# EAGLE schematic cyberstick3_new (EAGLE 7.4.0)
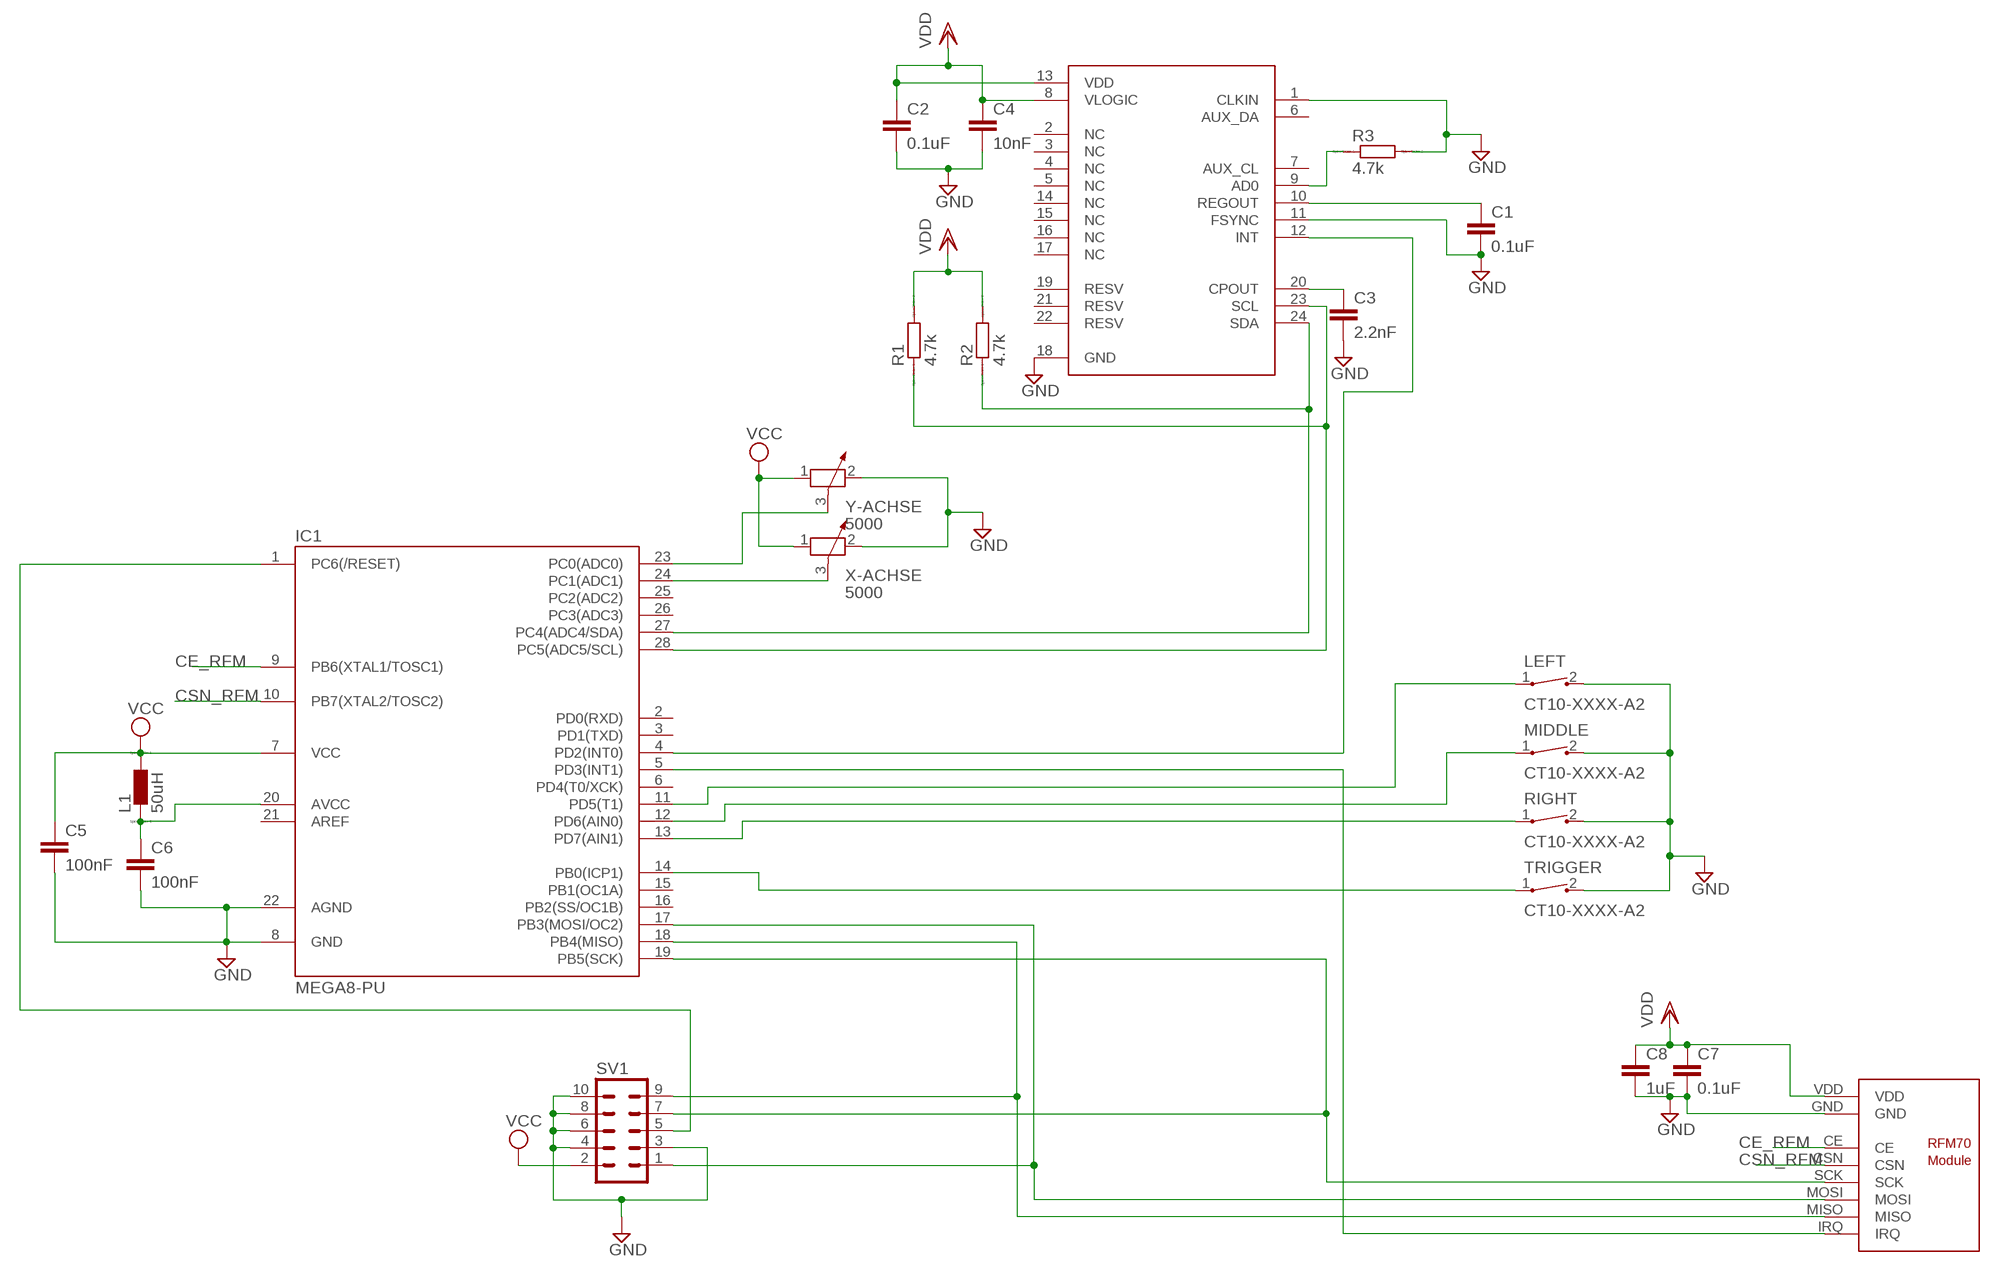
[diagram p0: schematic, sheet 1]

## Parts
C1  0.1uF  C2,5-3  [C2.5-3]
C2  0.1uF  C2,5-3  [C2.5-3]
C3  2.2nF  C2,5-3  [C2.5-3]
C4  10nF  C2,5-3  [C2.5-3]
C5  100nF  C2,5-3  [C2.5-3]
C6  100nF  C2,5-3  [C2.5-3]
C7  0.1uF  C2,5-3  [C2.5-3]
C8  1uF  C2,5-3  [C2.5-3]
IC1  MEGA8-PU  [DIL28-3]
L1  50uH  L0204/7  [0204/7]
LEFT  CT10-XXXX-A2  [CT10-XXXX-A2]
MIDDLE  CT10-XXXX-A2  [CT10-XXXX-A2]
R1  4.7k  R0204/7  [0204/7]
R2  4.7k  R0204/7  [0204/7]
R3  4.7k  R0204/7  [0204/7]
RIGHT  CT10-XXXX-A2  [CT10-XXXX-A2]
SV1  MA05-2  [MA05-2]
TRIGGER  CT10-XXXX-A2  [CT10-XXXX-A2]
U1  MPU6050  [MPU6050]
U$2  RFM70  [RFM70]
X-ACHSE  5000  POTENTIOMETER_PT-10  [PT-10]
Y-ACHSE  5000  POTENTIOMETER_PT-10  [PT-10]

## Nets
CE_RFM: IC1.9(PB6(XTAL1/TOSC1)) U$2.CE
CSN_RFM: IC1.10(PB7(XTAL2/TOSC2)) U$2.CSN
GND: C1.2 C2.2 C3.2 C4.2 C5.2 C6.2 C7.2 C8.2 IC1.8(GND) IC1.22(AGND) LEFT.2 MIDDLE.2 R3.2 RIGHT.2 SV1.3 SV1.4 SV1.6 SV1.8 SV1.10 TRIGGER.2 U1.1(CLKIN) U1.11(FSYNC) U1.18(GND) U$2.GND X-ACHSE.2 Y-ACHSE.2
N$1: IC1.14(PB0(ICP1)) TRIGGER.1
N$2: IC1.4(PD2(INT0)) U1.12(INT)
N$3: IC1.19(PB5(SCK)) SV1.7 U$2.SCK
N$4: IC1.13(PD7(AIN1)) RIGHT.1
N$6: IC1.24(PC1(ADC1)) X-ACHSE.3
N$7: IC1.23(PC0(ADC0)) Y-ACHSE.3
N$8: IC1.17(PB3(MOSI/OC2)) SV1.1 U$2.MOSI
N$9: IC1.1(PC6(/RESET)) SV1.5
N$10: IC1.27(PC4(ADC4/SDA)) R2.1 U1.24(SDA)
N$11: IC1.12(PD6(AIN0)) MIDDLE.1
N$13: C3.1 U1.20(CPOUT)
N$14: C1.1 U1.10(REGOUT)
N$15: IC1.18(PB4(MISO)) SV1.9 U$2.MISO
N$16: IC1.28(PC5(ADC5/SCL)) R1.1 U1.23(SCL)
N$17: IC1.11(PD5(T1)) LEFT.1
N$18: C6.1 IC1.20(AVCC) L1.2
N$19: IC1.5(PD3(INT1)) U$2.IRQ
N$21: R3.1 U1.9(AD0)
VCC: C5.1 IC1.7(VCC) L1.1 SV1.2 X-ACHSE.1 Y-ACHSE.1
VDD: C2.1 C4.1 C7.1 C8.1 R1.2 R2.2 U1.8(VLOGIC) U1.13(VDD) U$2.VDD
Unconnected: IC1.2(PD0(RXD)) IC1.3(PD1(TXD)) IC1.6(PD4(T0/XCK)) IC1.15(PB1(OC1A)) IC1.16(PB2(SS/OC1B)) IC1.21(AREF) IC1.25(PC2(ADC2)) IC1.26(PC3(ADC3)) U1.2(NC) U1.3(NC) U1.4(NC) U1.5(NC) U1.6(AUX_DA) U1.7(AUX_CL) U1.14(NC) U1.15(NC) U1.16(NC) U1.17(NC) U1.19(RESV) U1.21(RESV) U1.22(RESV)

## Library data of the parts
C1-C8 = capacitor-wima:C: CAPACITOR naming: grid - package width
IC1 = avr-7:MEGA8-PU
L1 = eagle-ltspice:L: INDUCTOR, European symbol; SPICEMODEL: NONE; SPICEPREFIX: L
LEFT MIDDLE RIGHT TRIGGER = switch-coto:CT10-XXXX-: CT10 Series Molded Switch Source: www.cotorelay.com .. Coto_Technology__CT10-1530-G1.pdf
R1-R3 = eagle-ltspice:R: RESISTOR, European symbol; SPICEMODEL: NONE; SPICEPREFIX: R
SV1 = con-lstb:MA05-2: PIN HEADER; OC_FARNELL: unknown; OC_NEWARK: unknown
U1 = attiny88 mpu6050:MPU6050: MPU6050 - Motion Processing Unit w/ Gyroscope, Accelerometer and Temperature Sensor The MPU - 6050 is the world’s first integrated 6 - axis MotionTracking device that combines a 3 - axis gyroscope, 3 - axis accelerometer, and a Digita l Motion Processor™ (DMP) all in a small 4x4x0.9mm package. Technical Specifications: VCC: 2.375V-3.46V VLOGIC: 1.71v to VDD Serial Interfaces Supported: I²C Temp Range: -40C---+85C More Information at : http://www.cdiweb.com/datasheets/invensense/MPU-6050_DataSheet_V3%204.pdf HLRS 2014 VIS Praktikant Harry Schwarz
U$2 = Ulli:RFM70: RFM70 2.4 Ghz Funkmodul Autor: Daniel Weber Website: http://projects.web4clans.com Email: daniel.weber@web4clans.com
X-ACHSE Y-ACHSE = rcl:POTENTIOMETER_: Potentiometer